# EAGLE design communication-hub (EAGLE 9.2.2)
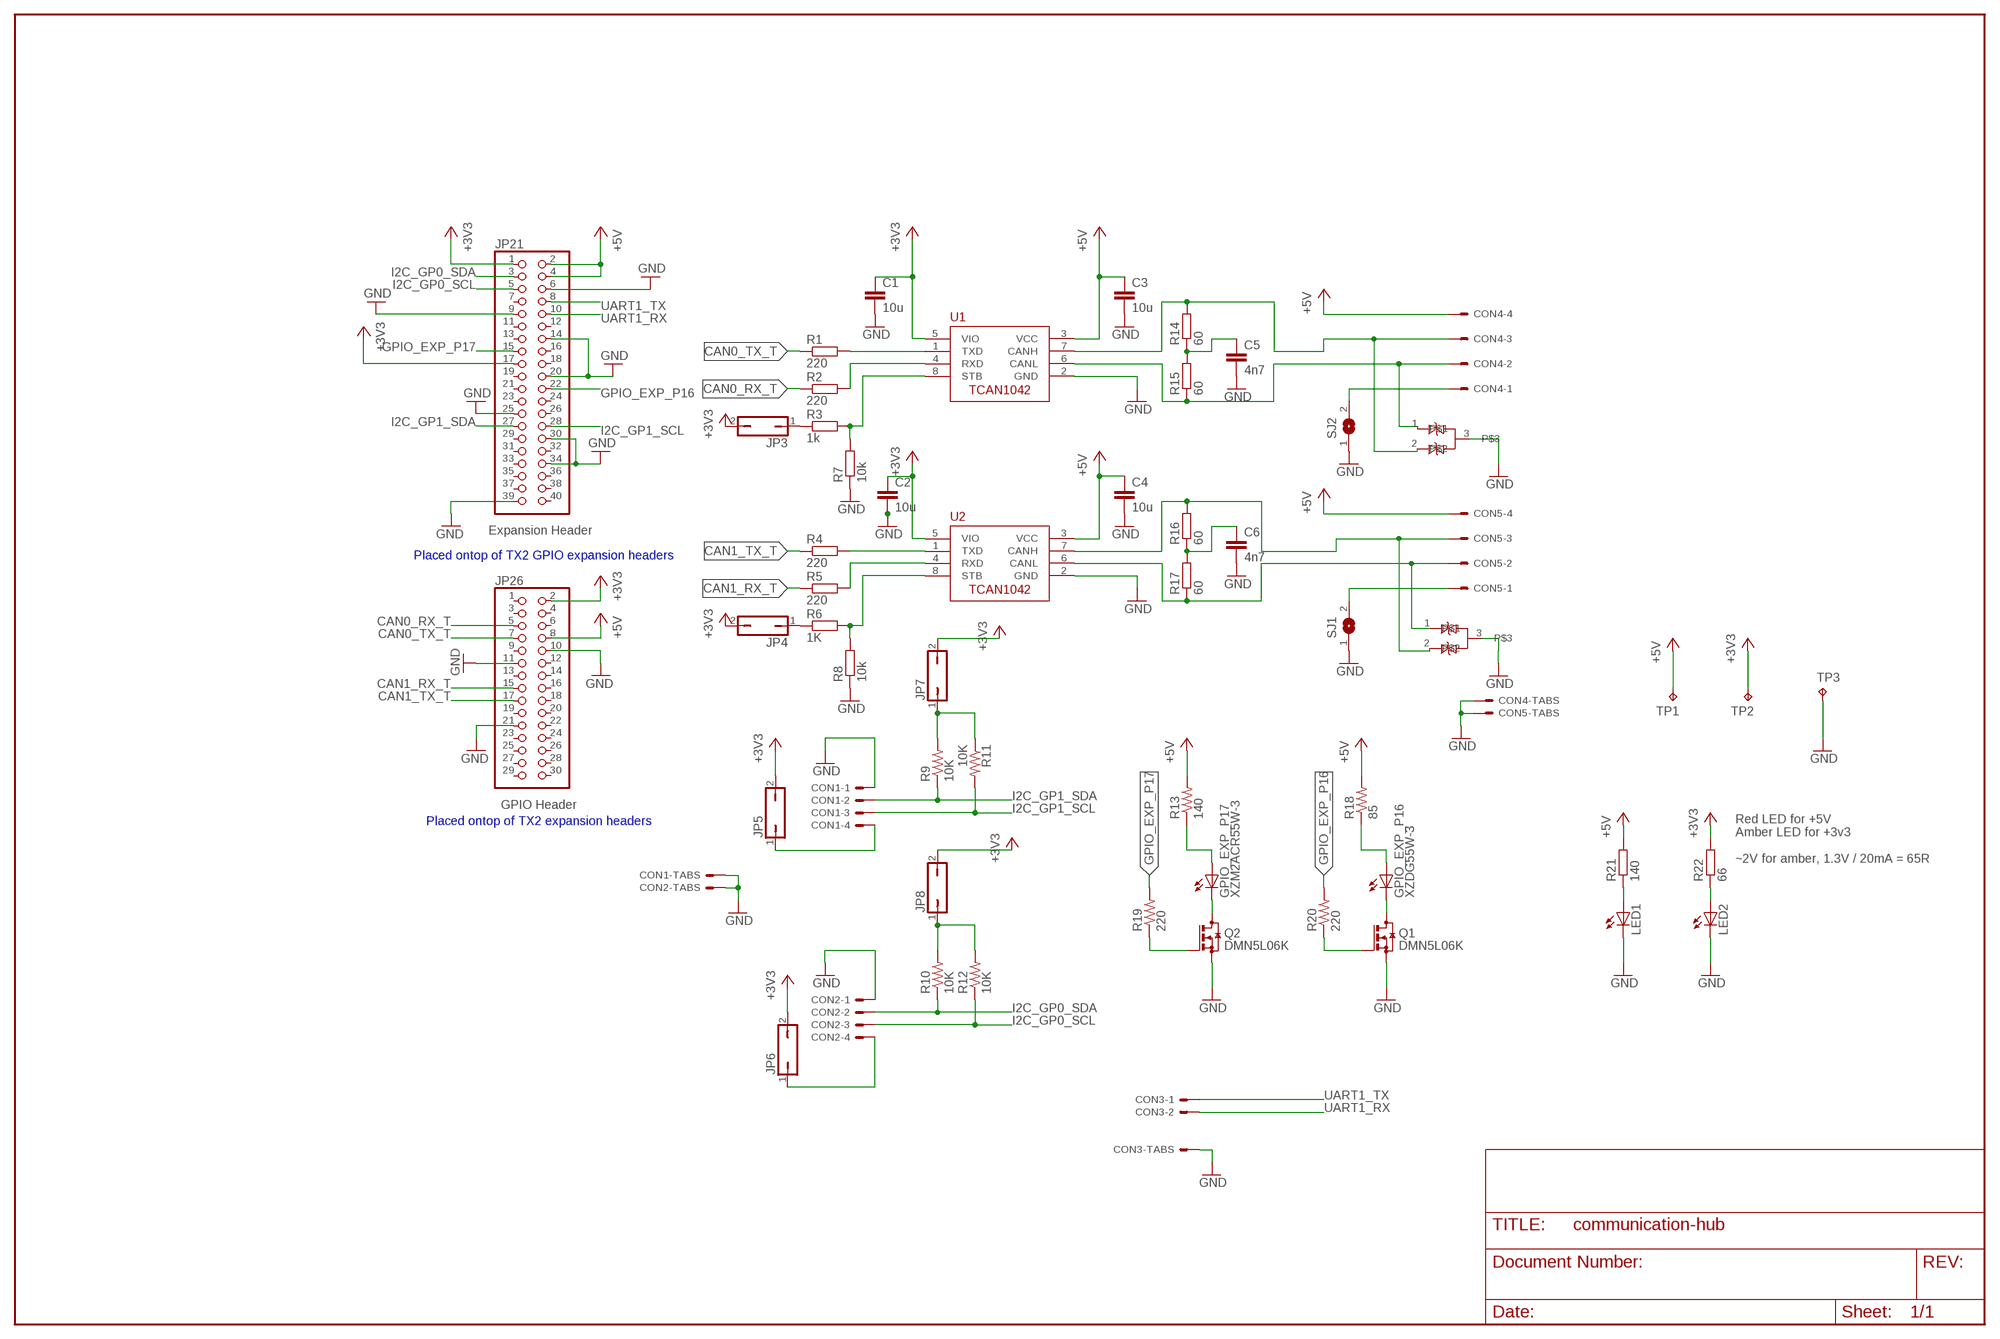
[diagram p0: schematic, sheet 1]

## Parts
C1  10u  C-EUC0805  [C0805]
C2  10u  C-EUC0805  [C0805]
C3  10u  C-EUC0805  [C0805]
C4  10u  C-EUC0805  [C0805]
C5  4n7  C-EUC0805  [C0805]
C6  4n7  C-EUC0805  [C0805]
CON1  SM04B-GHS-TB  [SM04B-GHS-TB]
CON2  SM04B-GHS-TB  [SM04B-GHS-TB]
CON3  SM02B-GHS-TB  [SM02B-GHS-TB]
CON4  SM04B-GHS-TB  [SM04B-GHS-TB]
CON5  SM04B-GHS-TB  [SM04B-GHS-TB]
GPIO_EXP_P16  XZDG55W-3  LED_E  [LED_1206]
GPIO_EXP_P17  XZM2ACR55W-3  LED_E  [LED_1206]
JP3  JP1Q  [JP1]
JP4  JP1Q  [JP1]
JP5  JP1Q  [JP1]
JP6  JP1Q  [JP1]
JP7  JP1Q  [JP1]
JP8  JP1Q  [JP1]
JP21  PINHD-2X20  [2X20]
JP26  PINHD-2X15  [2X15]
LED1  LEDSMT1206  [1206]
LED2  LEDSMT1206  [1206]
Q1  DMN5L06K  BSS123  [SOT23]
Q2  DMN5L06K  BSS123  [SOT23]
R1  220  R-EU_R0805  [R0805]
R2  220  R-EU_R0805  [R0805]
R3  1k  R-EU_R0805  [R0805]
R4  220  R-EU_R0805  [R0805]
R5  220  R-EU_R0805  [R0805]
R6  1K  R-EU_R0805  [R0805]
R7  10k  R-EU_R0805  [R0805]
R8  10k  R-EU_R0805  [R0805]
R9  10K  R-US_M1206  [M1206]
R10  10K  R-US_M1206  [M1206]
R11  10K  R-US_M1206  [M1206]
R12  10K  R-US_M1206  [M1206]
R13  140  R-US_M1206  [M1206]
R14  60  R-EU_R1206  [R1206]
R15  60  R-EU_R1206  [R1206]
R16  60  R-EU_R1206  [R1206]
R17  60  R-EU_R1206  [R1206]
R18  85  R-US_M1206  [M1206]
R19  220  R-US_R0805  [R0805]
R20  220  R-US_R0805  [R0805]
R21  140  R-EU_R0805  [R0805]
R22  66  R-EU_R0805  [R0805]
SJ1  SJ  [SJ]
SJ2  SJ  [SJ]
TP1  TPB2,54  [B2,54]
TP2  TPB2,54  [B2,54]
TP3  TPB2,54  [B2,54]
U1  TCAN1042HVDR  [SO-8]
U2  TCAN1042HVDR  [SO-8]
U$4  NUP2105L  [SOT23]
U$5  NUP2105L  [SOT23]

## Nets
+3V3: C1.1 C2.1 JP3.2 JP4.2 JP5.2 JP6.2 JP7.2 JP8.2 JP21.1 JP21.17 JP26.2 R22.2 TP2.TP U1.5(VIO) U2.5(VIO)
+5V: C3.1 C4.1 CON4.P$4 CON5.P$4 JP21.2 JP21.4 JP26.8 R13.2 R18.2 R21.2 TP1.TP U1.3(VCC) U2.3(VCC)
CAN0_RX_T: JP26.5 R2.1
CAN0_TX_T: JP26.7 R1.1
CAN1_RX_T: JP26.15 R5.1
CAN1_TX_T: JP26.17 R4.1
GND: C1.2 C2.2 C3.2 C4.2 C5.2 C6.2 CON1.P$1 CON1.P$5 CON1.P$6 CON2.P$1 CON2.P$5 CON2.P$6 CON3.P$3 CON3.P$4 CON4.P$5 CON4.P$6 CON5.P$5 CON5.P$6 JP21.6 JP21.9 JP21.14 JP21.20 JP21.25 JP21.30 JP21.34 JP21.39 JP26.10 JP26.11 JP26.21 LED1.C LED2.C Q1.2(S) Q2.2(S) R7.1 R8.1 SJ1.1 SJ2.1 TP3.TP U1.2(GND) U2.2(GND) U$4.3 U$5.3
GPIO_EXP_P16: JP21.22 R20.2
GPIO_EXP_P17: JP21.15 R19.2
I2C_GP0_SCL: CON2.P$3 JP21.5 R12.1
I2C_GP0_SDA: CON2.P$2 JP21.3 R10.1
I2C_GP1_SCL: CON1.P$3 JP21.28 R11.2
I2C_GP1_SDA: CON1.P$2 JP21.27 R9.1
N$1: JP8.1 R10.2 R12.2
N$2: JP7.1 R9.2 R11.1
N$3: GPIO_EXP_P17.A R13.1
N$4: GPIO_EXP_P16.A R18.1
N$5: CON1.P$4 JP5.1
N$6: CON2.P$4 JP6.1
N$7: CON5.P$1 SJ1.2
N$8: CON4.P$1 SJ2.2
N$9: GPIO_EXP_P17.C Q2.3(D)
N$10: GPIO_EXP_P16.C Q1.3(D)
N$11: Q2.1(G) R19.1
N$12: Q1.1(G) R20.1
N$13: LED1.A R21.1
N$14: LED2.A R22.1
N$19: C5.1 R14.1 R15.2
N$20: C6.1 R16.1 R17.2
N$21: CON5.P$3 R16.2 U2.7(CANH) U$5.2
N$22: CON5.P$2 R17.1 U2.6(CANL) U$5.1
N$23: CON4.P$3 R14.2 U1.7(CANH) U$4.2
N$24: CON4.P$2 R15.1 U1.6(CANL) U$4.1
N$25: R1.2 U1.1(TXD)
N$26: R2.2 U1.4(RXD)
N$27: R3.2 R7.2 U1.8(STB)
N$28: R4.2 U2.1(TXD)
N$29: R5.2 U2.4(RXD)
N$30: R6.2 R8.2 U2.8(STB)
N$33: JP3.1 R3.1
N$34: JP4.1 R6.1
UART1_RX: CON3.P$2 JP21.10
UART1_TX: CON3.P$1 JP21.8
Unconnected: JP21.7 JP21.11 JP21.12 JP21.13 JP21.16 JP21.18 JP21.19 JP21.21 JP21.23 JP21.24 JP21.26 JP21.29 JP21.31 JP21.32 JP21.33 JP21.35 JP21.36 JP21.37 JP21.38 JP21.40 JP26.1 JP26.3 JP26.4 JP26.6 JP26.9 JP26.12 JP26.13 JP26.14 JP26.16 JP26.18 JP26.19 JP26.20 JP26.22 JP26.23 JP26.24 JP26.25 JP26.26 JP26.27 JP26.28 JP26.29 JP26.30

## Notes on the sheet
- Expansion Header
- Placed ontop of TX2 GPIO expansion headers
- GPIO Header
- Placed ontop of TX2 expansion headers
- Red LED for +5V
  Amber LED for +3v3
  
  ~2V for amber, 1.3V / 20mA = 65R

## Library data of the parts
C1-C6 = resistor:C-EU: CAPACITOR, European symbol
CON1 CON2 CON4 CON5 = ARVP:SM04B-GHS-TB
CON3 = ARVP:SM02B-GHS-TB
GPIO_EXP_P16 GPIO_EXP_P17 = eagle-ltspice:LED_E: LED Source: http://www.osram.convergy.de Source: www.luxeon.com Source: www.kingbright.com; SPICEMODEL: NONE; SPICEPREFIX: D; SPICETYPE: diode
JP3-JP8 = jumper:JP1Q: JUMPER
JP21 = commhub:PINHD-2X20: PIN HEADER
JP26 = commhub:PINHD-2X15: PIN HEADER
LED1 LED2 = led:LED: LED OSRAM: - CHIPLED LG R971, LG N971, LY N971, LG Q971, LY Q971, LO R971, LY R971 LH N974, LH R974 LS Q976, LO Q976, LY Q976 LO Q996 - Hyper CHIPLED LW Q18S LB Q993, LB Q99A, LB R99A - SideLED LS A670, LO A670, LY A670, LG A670, LP A670 LB A673, LV A673, LT A673, LW A673 LH A674 LY A675 LS A676, LA A676, LO A676, LY A676, LW A676 LS A679, LY A679, LG A679 - Hyper Micro SIDELED® LS Y876, LA Y876, LO Y876, LY Y876 LT Y87S - SmartLED LW L88C, LW L88S LB L89C, LB L89S, LG L890 LS L89K, LO L89K, LY L89K LS L896, LA L896, LO L896, LY L896 - TOPLED LS T670, LO T670, LY T670, LG T670, LP T670 LSG T670, LSP T670, LSY T670, LOP T670, LYG T670 LG T671, LOG T671, LSG T671 LB T673, LV T673, LT T673, LW T673 LH T674 LS T676, LA T676, LO T676, LY T676, LB T676, LH T676, LSB T676, LW T676 LB T67C, LV T67C, LT T67C, LS T67K, LO T67K, LY T67K, LW E67C LS E67B, LA E67B, LO E67B, LY E67B, LB E67C, LV E67C, LT E67C LW T67C LS T679, LY T679, LG T679 LS T770, LO T770, LY T770, LG T770, LP T770 LB T773, LV T773, LT T773, LW T773 LH T774 LS E675, LA E675, LY E675, LS T675 LS T776, LA T776, LO T776, LY T776, LB T776 LHGB T686 LT T68C, LB T68C - Hyper Mini TOPLED® LB M676 - Mini TOPLED Santana® LG M470 LS M47K, LO M47K, LY M47K Source: http://www.osram.convergy.de LUXEON: - LUMILED® LXK2-PW12-R00, LXK2-PW12-S00, LXK2-PW14-U00, LXK2-PW14-V00 LXK2-PM12-R00, LXK2-PM12-S00, LXK2-PM14-U00 LXK2-PE12-Q00, LXK2-PE12-R00, LXK2-PE12-S00, LXK2-PE14-T00, LXK2-PE14-U00 LXK2-PB12-K00, LXK2-PB12-L00, LXK2-PB12-M00, LXK2-PB14-N00, LXK2-PB14-P00, LXK2-PB14-Q00 LXK2-PR12-L00, LXK2-PR12-M00, LXK2-PR14-Q00, LXK2-PR14-R00 LXK2-PD12-Q00, LXK2-PD12-R00, LXK2-PD12-S00 LXK2-PH12-R00, LXK2-PH12-S00 LXK2-PL12-P00, LXK2-PL12-Q00, LXK2-PL12-R00 Source: www.luxeon.com KINGBRIGHT: KA-3528ASYC Source: www.kingbright.com
Q1 Q2 = transistor-small-signal:BSS123: N-CHANNEL MOS FET
R1-R8 R14-R17 R21 R22 = resistor:R-EU_: RESISTOR, European symbol
R9-R13 R18 = resistor:R-US_: RESISTOR, American symbol
R19 R20 = rcl:R-US_: RESISTOR, American symbol
SJ1 SJ2 = jumper:SJ: SMD solder JUMPER
TP1-TP3 = testpad:TP: Test pad
U1 U2 = ARVP:TCAN1042HVDR
U$4 U$5 = ARVP:NUP2105L

## Board
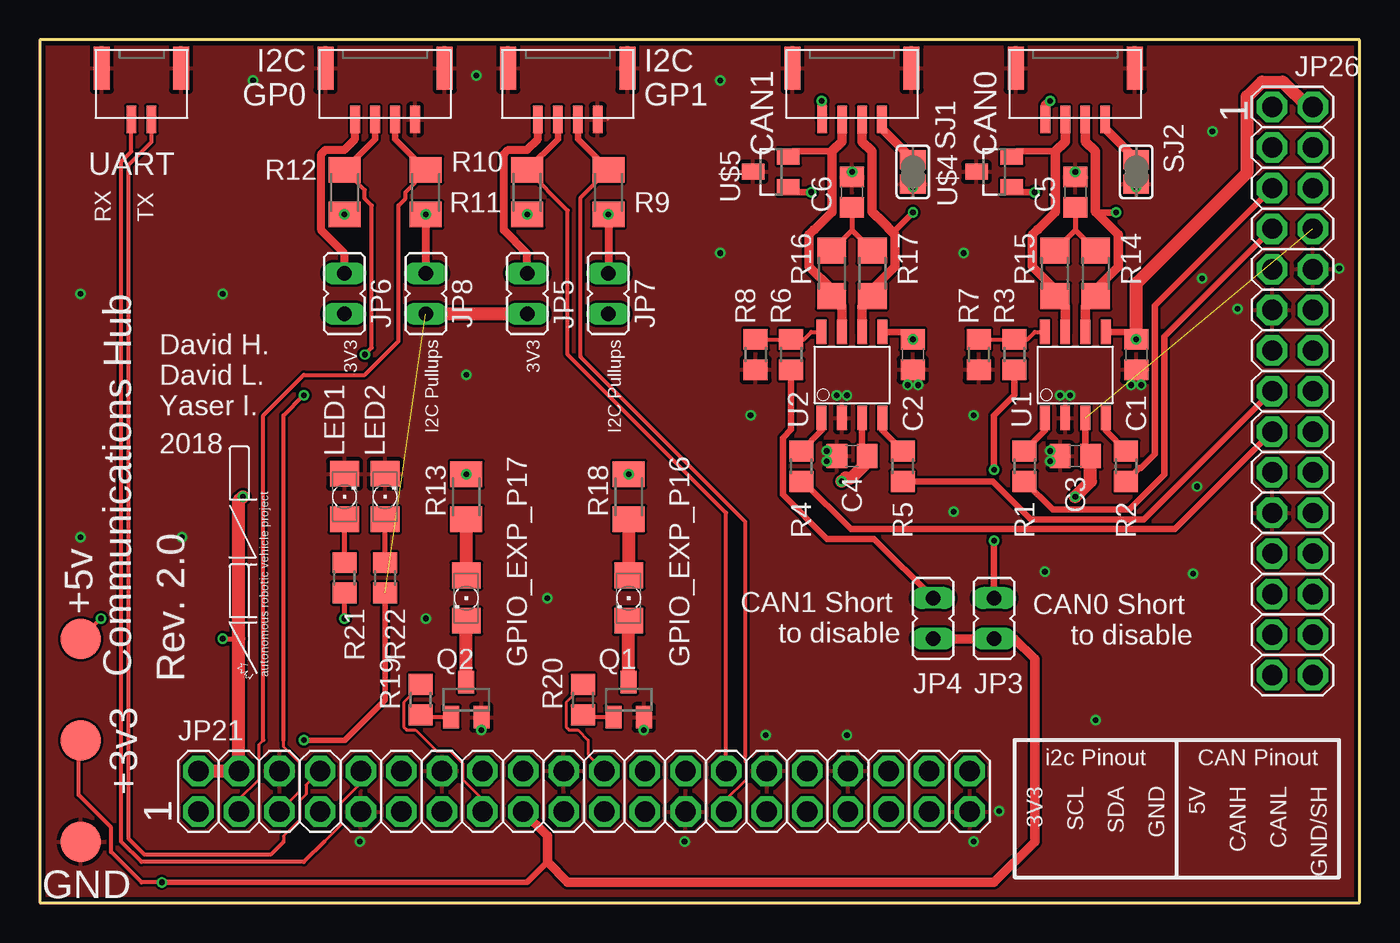
[diagram p1: board, top side]
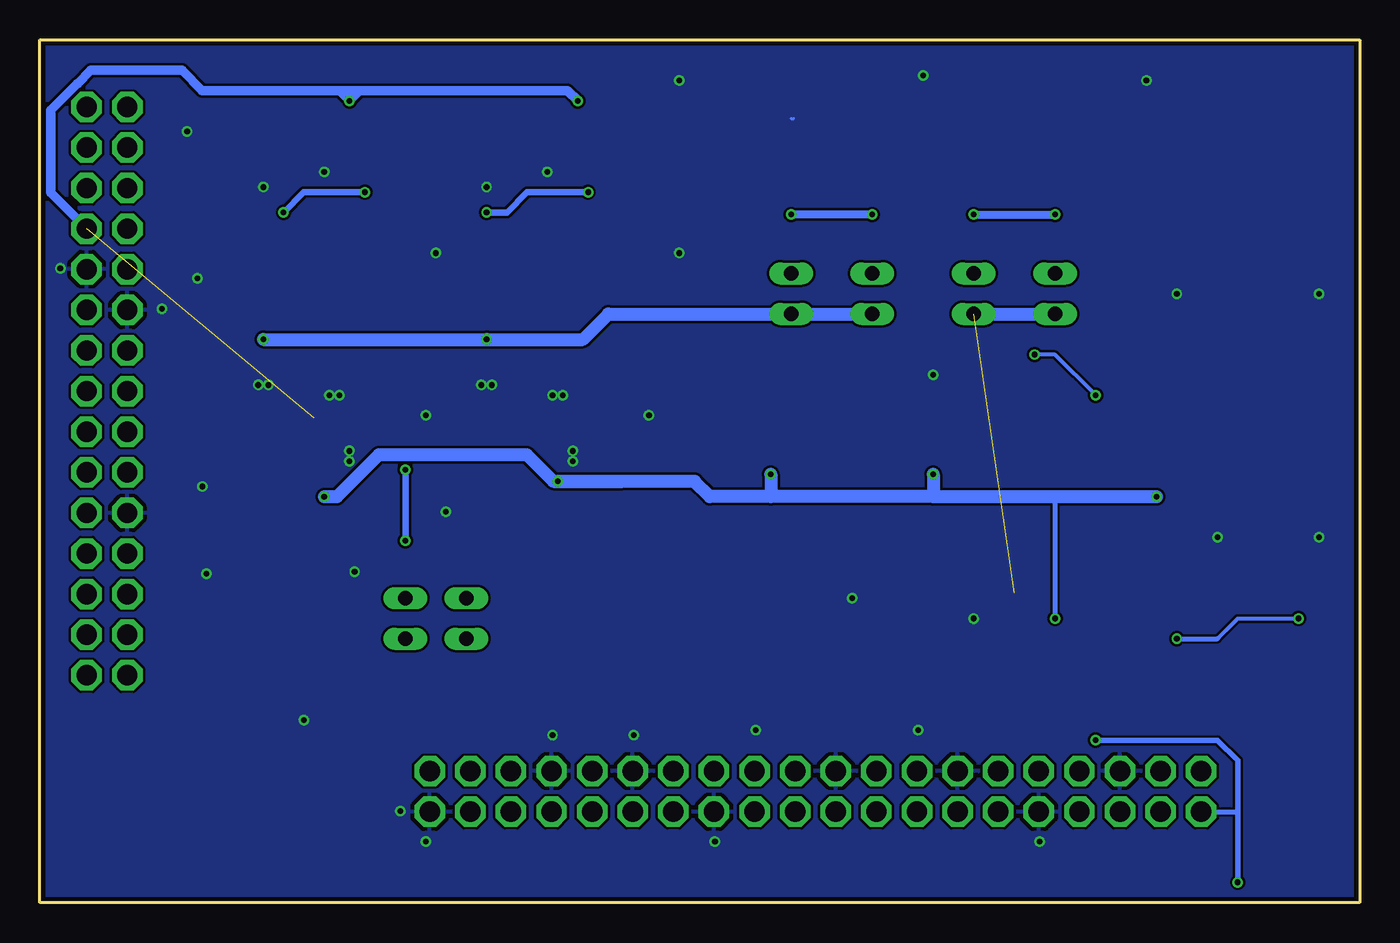
[diagram p2: board, bottom side, seen from below]

Size 82.55 x 53.98 mm. Coordinates in mm from the lower left corner, seen from the top.
Outline: 0,0 82.55,0 82.55,53.98 0,53.98 0,0
Copper layers (1*16): Top 0.035mm / dielectric 1.5mm / Bottom 0.035mm
Design rules "JLCPCB2Layer": minimum track width 6mil, minimum drill 10mil, track to track 6mil, track to pad 6mil, pad to pad 6mil, via to via 6mil, smd to smd 0mil, copper to edge 10mil, drill to drill 10mil, minimum pad ring 6mil, minimum via ring 6mil, stop-mask expansion 2mil, vias tented up to drill 100mil, thermal gap 10mil
Milling: 4 lines

### Footprints (pad centres in the part's own frame; a part is rotated, then mirrored left to right if it is on the bottom)
C0805 = smd 1.3 x 1.5: 1 -0.95,0; 2 0.95,0
SM04B-GHS-TB = smd 0.6 x 1.7: P$1 -1.875,0.85; P$2 -0.625,0.85; P$3 0.625,0.85; P$4 1.875,0.85 | smd 1 x 2.7: P$5 -3.725,-2.35; P$6 3.725,-2.35
SM02B-GHS-TB = smd 0.6 x 1.7: P$1 -0.625,0.85; P$2 0.625,0.85 | smd 1 x 2.7: P$3 -2.475,-2.35; P$4 2.475,-2.35
LED_1206 = smd 1.6 x 1.803: A -1.422,0; C 1.422,0
JP1 = drill 0.914 long: 1 0,-1.27; 2 0,1.27
2X20 = drill 1.27 octagon: 1 -24.13,-1.27; 2 -24.13,1.27; 3 -21.59,-1.27; 4 -21.59,1.27; 5 -19.05,-1.27; 6 -19.05,1.27; 7 -16.51,-1.27; 8 -16.51,1.27; 9 -13.97,-1.27; 10 -13.97,1.27; 11 -11.43,-1.27; 12 -11.43,1.27; 13 -8.89,-1.27; 14 -8.89,1.27; 15 -6.35,-1.27; 16 -6.35,1.27; 17 -3.81,-1.27; 18 -3.81,1.27; 19 -1.27,-1.27; 20 -1.27,1.27; 21 1.27,-1.27; 22 1.27,1.27; 23 3.81,-1.27; 24 3.81,1.27; 25 6.35,-1.27; 26 6.35,1.27; 27 8.89,-1.27; 28 8.89,1.27; 29 11.43,-1.27; 30 11.43,1.27; 31 13.97,-1.27; 32 13.97,1.27; 33 16.51,-1.27; 34 16.51,1.27; 35 19.05,-1.27; 36 19.05,1.27; 37 21.59,-1.27; 38 21.59,1.27; 39 24.13,-1.27; 40 24.13,1.27
2X15 = drill 1.27 octagon: 1 -17.78,-1.27; 2 -17.78,1.27; 3 -15.24,-1.27; 4 -15.24,1.27; 5 -12.7,-1.27; 6 -12.7,1.27; 7 -10.16,-1.27; 8 -10.16,1.27; 9 -7.62,-1.27; 10 -7.62,1.27; 11 -5.08,-1.27; 12 -5.08,1.27; 13 -2.54,-1.27; 14 -2.54,1.27; 15 0,-1.27; 16 0,1.27; 17 2.54,-1.27; 18 2.54,1.27; 19 5.08,-1.27; 20 5.08,1.27; 21 7.62,-1.27; 22 7.62,1.27; 23 10.16,-1.27; 24 10.16,1.27; 25 12.7,-1.27; 26 12.7,1.27; 27 15.24,-1.27; 28 15.24,1.27; 29 17.78,-1.27; 30 17.78,1.27
1206 = smd 1.6 x 1.803: A -1.422,0; C 1.422,0
SOT23 = smd 1 x 1.4: 1 -0.95,-1.1; 2 0.95,-1.1; 3 0,1.1
R0805 = smd 1.3 x 1.5: 1 -0.95,0; 2 0.95,0
M1206 = smd 1.6 x 2: 1 -1.4,0; 2 1.4,0
R1206 = smd 1.6 x 1.803: 1 -1.422,0; 2 1.422,0
SJ = smd 1.168 x 1.6: 1 -0.762,0; 2 0.762,0
B2,54 = smd 2.54 x 2.54: TP 0,0
SO-8 = smd 1.524 x 0.61: 1 -2.692,1.905; 2 -2.692,0.635; 3 -2.692,-0.635; 4 -2.692,-1.905; 5 2.692,-1.905; 6 2.692,-0.635; 7 2.692,0.635; 8 2.692,1.905

### Placement (x,y rotation side)
C1  68.58,34.29 270 top
C2  54.61,34.29 270 top
C3  64.77,27.94 180 top
C4  50.8,27.94 180 top
C5  64.77,44.45 90 top
C6  50.8,44.45 90 top
CON1  33.02,49.85 180 top
CON2  21.59,49.85 180 top
CON3  6.35,49.85 180 top
CON4  64.77,49.85 180 top
CON5  50.8,49.85 180 top
GPIO_EXP_P16  36.83,19.05 270 top
GPIO_EXP_P17  26.67,19.05 270 top
JP3  59.69,17.78 180 top
JP4  55.88,17.78 180 top
JP5  30.48,38.1 180 top
JP6  19.05,38.1 180 top
JP7  35.56,38.1 180 top
JP8  24.13,38.1 180 top
JP21  34.04,6.96 0 top
JP26  78.36,32 270 top
LED1  19.05,25.4 90 top
LED2  21.59,25.4 90 top
Q1  36.83,12.7 0 top
Q2  26.67,12.7 0 top
R1  61.59,27.3 90 top
R2  67.94,27.3 90 top
R3  60.96,34.29 90 top
R4  47.62,27.3 90 top
R5  53.98,27.3 90 top
R6  46.99,34.29 90 top
R7  58.74,34.29 90 top
R8  44.77,34.29 90 top
R9  35.56,44.45 270 top
R10  24.13,44.45 270 top
R11  30.48,44.45 90 top
R12  19.05,44.45 270 top
R13  26.67,25.4 90 top
R14  63.5,39.37 270 top
R15  66.04,39.37 90 top
R16  49.53,39.37 270 top
R17  52.07,39.37 90 top
R18  36.83,25.4 90 top
R19  23.81,12.7 90 top
R20  33.97,12.7 90 top
R21  19.05,20.32 270 top
R22  21.59,20.32 270 top
SJ1  54.61,45.72 90 top
SJ2  68.58,45.72 90 top
TP1  2.54,16.51 0 top
TP2  2.54,10.16 0 top
TP3  2.54,3.81 0 top
U1  64.77,33.02 90 top
U2  50.8,33.02 90 top
U$1  [ARVP]  14.29,14.13 90 top
U$2  [A4L-LOC]  -85.98,-70.74 0 top  (outside the outline)
U$4  59.69,45.72 90 top
U$5  45.72,45.72 90 top

### Tracks (layer width: path | path; a pad name or v marks a point on that pad's centre or on a via)
+3V3  (via drill 0.35)  (1 unrouted)
  Top 0.254: v7.62,1.27 6.35,1.27 4.45,3.17 4.45,4.7 2.41,6.73 2.41,10.03 TP2.TP
  Top 0.356: 31.75,2.54 30.48,1.27 v7.62,1.27 | v16.51,10.16 19.05,10.16 21.59,12.7 R22.2
  Top 0.406: C1.1 68.11,35.71 U1.5 | C2.1 54.14,35.71 U2.5
  Top 0.61: JP21.17 31.75,4.17 31.75,2.54 33.02,1.27 59.69,1.27 62.23,3.81 62.23,15.24 60.96,16.51 JP3.2 JP4.2
  Top 0.813: JP5.2 JP8.2 | JP26.2 79.3,49.78 77.74,51.35 76.44,51.35 75.53,50.43 75.53,45.68 68.58,38.73 C1.1
  Bottom 0.305: JP21.1 7.64,5.69 7.62,5.71
  Bottom 0.356: v7.62,1.27 7.62,5.71 7.62,8.89 8.89,10.16 v16.51,10.16
  Bottom 0.813: JP5.2 JP7.2 46.99,36.83 48.58,35.24 C2.1 C1.1 | JP8.2 JP6.2
  other vias: 54.61,35.24 68.58,35.24
+5V  (via drill 0.35)  (1 unrouted)
  Top 0.254: v3.81,17.78 TP1.TP
  Top 0.305: v11.43,16.51 12.45,16.51 | v19.05,17.78 R21.2
  Top 0.406: C4.1 51.44,28.25 U2.3 | C3.1 65.41,28.25 U1.3
  Top 0.61: v48.9,50.16 48.92,50.13 CON5.P$4 | v63.18,50.16 62.9,49.88 CON4.P$4
  Top 0.813: JP21.2 JP21.4 12.45,16.51 12.45,25.15 v12.7,25.4 | v64.77,25.4 65.72,26.35 C3.1 | v50.16,26.35 50.39,26.58 50.75,26.58 51.75,27.58 C4.1
  Bottom 0.254: 8.89,16.51 7.62,17.78 v3.81,17.78
  Bottom 0.305: v11.43,16.51 8.89,16.51 | 19.05,25.4 v19.05,17.78
  Bottom 0.61: JP26.8 81.89,44.42 81.89,49.59 80.23,51.24 80.2,51.24 79.38,52.07 73.66,52.07 72.39,50.8 63.82,50.8 | 63.82,50.8 v63.18,50.16 62.55,50.8 | 62.55,50.8 49.53,50.8 v48.9,50.16 | 63.82,50.8 62.55,50.8
  Bottom 0.813: 26.67,25.4 19.05,25.4 v12.7,25.4 | 26.67,25.4 36.83,25.4 | v50.16,26.35 46.12,26.35 | R13.2 26.67,25.4 | R18.2 36.83,25.4 | 36.83,25.4 40.64,25.4 41.59,26.35 v50.16,26.35 | v50.16,26.35 50.43,26.35 52.1,28.03 61.35,28.03 63.97,25.4 v64.77,25.4
  other vias: 26.67,26.8 36.83,26.8
CAN0_RX_T
  Top 0.406: R2.1 68.79,27.2 68.86,27.2 69.74,28.07 69.74,37.35 JP26.5
CAN0_TX_T
  Top 0.406: JP26.7 70.35,35.42 70.35,26.78 68.15,24.59 63.36,24.59 R1.1
CAN1_RX_T
  Top 0.406: R5.1 59.62,26.36 62,23.98 69.06,23.98 JP26.15
CAN1_TX_T
  Top 0.406: R4.1 47.74,26.36 50.73,23.37 70.99,23.37 JP26.17
GND  (via drill 0.35)
  Top 0.203: 35.51,49 35.56,49.05
  Bottom 0.203: 35.56,49.05 35.4,49.05
  other vias: 50.8,45.72 64.77,45.72 68.9,32.38 68.26,32.38 54.29,32.38 54.93,32.38 63.18,28.26 63.18,27.62 49.21,28.26 49.21,27.62 49.85,31.75 50.48,31.75 63.82,31.75 64.45,31.75 68.58,44.77 54.61,44.77 27.3,51.75 13.34,51.44 42.55,51.44 81.28,39.69 2.54,38.1 2.54,22.86 11.43,38.1 8.89,22.86 26.67,33.02 31.75,19.05 62.87,20.7 42.55,40.64 58.42,30.48 44.45,30.48 57.78,40.64 66.04,11.43 72.14,20.57 20,3.81 40.32,3.81 24.13,17.78 60.01,5.71 58.42,3.81 27.62,10.79 37.78,10.79 74.93,37.15 57.15,24.45 72.39,26.04 72.71,39.05 73.34,48.26 50.48,10.48 45.4,10.48
  pour Top: 83.55,54.88 -0.82,54.88 -0.82,-0.82 83.55,-0.82
  pour Bottom: 83.55,54.88 -0.82,54.88 -0.82,-0.82 83.55,-0.82
GPIO_EXP_P16
  Top 0.203: R20.2 33.97,13.58 32.92,12.53 32.92,10.97 33.1,10.79 33.66,10.79 34.29,10.16 34.29,9.25 JP21.22
GPIO_EXP_P17
  Top 0.203: R19.2 23.81,13.58 22.76,12.53 22.76,10.97 22.94,10.79 23.5,10.79 24.8,9.49 25.67,9.49 26.43,8.72 26.43,7.71 27.69,6.45 JP21.15
I2C_GP0_SCL  (via drill 0.35)
  Top 0.203: 15.24,10.16 15.24,9.75 16.24,8.75 16.24,6.95 JP21.5
  Top 0.254: 15.24,10.16 15.24,30.48 v16.51,31.75 | v20.32,34.29 20.75,34.72 20.75,43.62 20.32,44.05 20.32,44.58 R12.1
  Top 0.406: R12.1 20.96,47.77 CON2.P$3
  Bottom 0.254: v16.51,31.75 19.05,34.29 v20.32,34.29
I2C_GP0_SDA
  Top 0.203: JP21.3 12.45,6.45 13.7,7.71 13.7,9.89 13.97,10.16
  Top 0.254: 13.97,10.16 13.97,30.48 16.51,33.02 20.32,33.02 22.43,35.13 22.43,43.62 22.86,44.05 22.86,44.45 24.13,45.72 R10.1
  Top 0.406: R10.1 22.21,47.77 CON2.P$2
I2C_GP1_SCL
  Top 0.254: JP21.28 42.93,24.38 33.02,34.29 33.02,43.31 R11.2
  Top 0.406: R11.2 32.4,47.77 CON1.P$3
I2C_GP1_SDA
  Top 0.203: JP21.27 42.93,6.45 44.18,7.71 44.18,8.75 44.13,8.8 44.13,9.21
  Top 0.254: 44.13,9.21 44.13,23.82 33.82,34.14 33.82,44.11 R9.1
  Top 0.406: R9.1 33.66,47.76 33.66,48.26 33.65,48.27 CON1.P$2
N$1  (via drill 0.35)
  Top 0.508: R10.2 JP8.1
  Bottom 0.508: R10.2 R12.2
  other vias: 24.13,43.05 19.05,43.05
N$2  (via drill 0.35)
  Top 0.508: R9.2 JP7.1
  Bottom 0.508: R11.1 R9.2
  other vias: 30.48,43.05 35.56,43.05
N$3
  Top 0.813: R13.1 GPIO_EXP_P17.A
N$4
  Top 0.813: R18.1 GPIO_EXP_P16.A
N$5
  Top 0.508: JP5.1 30.48,40.6 29.02,42.06 29.02,46.84 29.29,47.11 30.48,47.11 31.14,47.77 CON1.P$4
N$6
  Top 0.508: JP6.1 19.05,40.6 17.59,42.06 17.59,46.84 17.86,47.11 19.05,47.11 19.71,47.77 CON2.P$4
N$7
  Top 0.61: CON5.P$1 52.67,48.42 SJ1.2
N$8
  Top 0.61: CON4.P$1 66.64,48.42 SJ2.2
N$9
  Top 0.813: Q2.3 GPIO_EXP_P17.C
N$10
  Top 0.813: Q1.3 GPIO_EXP_P16.C
N$11
  Top 0.254: Q2.1 23.96,11.6 R19.1
N$12
  Top 0.254: Q1.1 34.12,11.6 R20.1
N$13
  Top 0.305: R21.1 LED1.A
N$14
  Top 0.305: R22.1 LED2.A
N$19
  Top 0.305: C5.1 64.77,42.06 | 64.77,42.06 R15.2 | 64.77,42.06 R14.1
N$20
  Top 0.305: C6.1 50.8,42.06 | 50.8,42.06 R17.2 | 50.8,42.06 R16.1
N$21
  Top 0.406: U$5.2 47.15,47 49.54,47
  Top 0.61: U2.7 50.16,37.31 R16.2 49.53,38.37 48.12,39.78 48.12,41.8 48.42,42.1 48.45,42.1 49.54,43.19 49.54,46.26 49.54,47 50.16,47.62 50.16,48.99 CON5.P$3
N$22  (via drill 0.35)
  Top 0.406: U$5.1 47.14,44.45 v48.26,44.45 | v54.61,43.18 53.36,41.93
  Top 0.61: U2.6 51.44,37.31 R17.1 52.07,38.37 53.48,39.78 53.48,41.8 53.36,41.93 52.72,42.56 52.06,43.22 52.06,47 51.44,47.62 51.44,48.99 CON5.P$2
  Bottom 0.406: v48.26,44.45 52.07,44.45 53.34,43.18 v54.61,43.18
N$23
  Top 0.406: U$4.2 61.13,47.01 63.52,47.01
  Top 0.61: U1.7 64.14,37.31 R14.2 63.5,38.37 62.09,39.78 62.09,41.8 62.39,42.1 62.42,42.1 63.51,43.19 63.51,46.26 63.52,46.27 63.52,47.01 64.14,47.62 64.14,48.99 CON4.P$3
N$24  (via drill 0.35)
  Top 0.406: U$4.1 61.11,44.45 v62.23,44.45 | v67.31,43.18 66.07,43.18 66.06,43.2
  Top 0.61: U1.6 65.41,37.31 R15.1 66.04,38.37 67.45,39.78 67.45,41.8 66.06,43.2 66.03,43.22 66.03,47 65.41,47.62 65.41,48.99 CON4.P$2
  Bottom 0.406: v67.31,43.18 66.04,44.45 v62.23,44.45
N$25
  Top 0.406: R1.2 62.87,29.52 U1.1
N$26
  Top 0.406: R2.2 66.67,29.52 U1.4
N$27
  Top 0.254: R7.2 R3.2 61.76,35.24 62.23,35.71 U1.8
N$28
  Top 0.406: R4.2 48.9,29.52 U2.1
N$29
  Top 0.406: R5.2 52.7,29.52 U2.4
N$30
  Top 0.254: R8.2 R6.2 47.79,35.24 48.26,35.71 U2.8
N$33  (via drill 0.35)
  Top 0.406: JP3.1 v59.69,22.63 | v59.69,27.09 59.69,30.48 60.96,31.75 R3.1
  Bottom 0.406: v59.69,22.63 v59.69,27.09
N$34
  Top 0.406: JP4.1 52.17,22.76 49.25,22.76 46.47,25.54 46.47,29.07 46.99,29.59 R6.1
UART1_RX
  Top 0.203: JP21.10 20.07,7.47 18.81,6.21 18.81,4.84 17.78,3.81
  Top 0.254: 17.78,3.81 16.51,2.54 6.35,2.54 5.08,3.81 5.08,46.35 5.71,46.99 5.71,48.67 CON3.P$2
UART1_TX
  Top 0.203: JP21.8 16.65,7.35 16.65,6.78 16.24,6.37 16.24,5.17 15.24,4.17 15.24,3.81
  Top 0.254: 15.24,3.81 14.43,3 6.54,3 5.54,4 5.54,46.17 6.97,47.6 CON3.P$1

### Text on the board
tPlace: +5v | +3v3 | GND
tNames: CAN1 | CAN0 | I2C / GP0 | I2C / GP1 | 1 | UART | RX | TX | 3V3 | I2C Pullups | 3V3 | I2C Pullups | David H. / David L. / Yaser I. | 2018 | CAN0 Short / to disable | CAN1 Short / to disable | Communications Hub | Rev. 2.0 | i2c Pinout | CAN Pinout | 3V3 | SCL | SDA | GND | 5V | CANH | CANL | GND/SH | 1
Document: 2 | Revision
tSilk: Shield GND | Shield GND | P16 | P17